# Altium project SimplePowerModule.PrjPCB
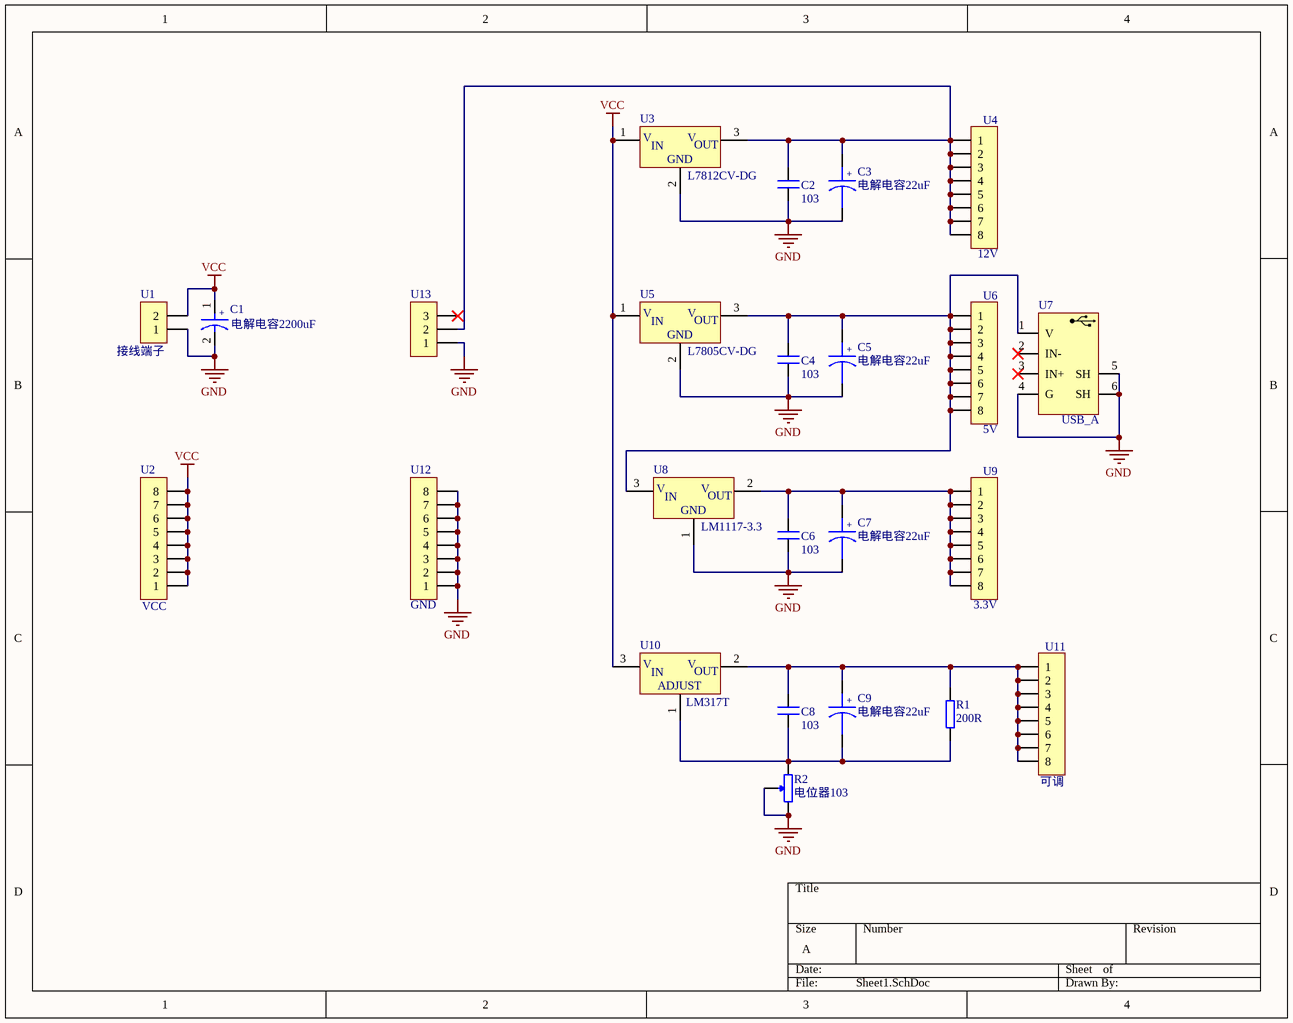
[diagram p0: Sheet1.SchDoc]
1 sheet, 24 parts. Net scope: global (net labels, ports and power ports of the same name join across sheets).
Board file: PCB1.PcbDoc

## Sheet Sheet1.SchDoc
size A

### Parts
C1  电解电容2200uF  [直插电解电容13*21]
C2  103  [贴片电容1206]
C3  电解电容22uF  [直插电解电容5*11]
C4  103  [贴片电容1206]
C5  电解电容22uF  [直插电解电容5*11]
C6  103  [贴片电容1206]
C7  电解电容22uF  [直插电解电容5*11]
C8  103  [贴片电容1206]
C9  电解电容22uF  [直插电解电容5*11]
R1  200R  [贴片电阻1206]
R2  电位器103  [电位器]
U1  接线端子  [KF128-3.81-2P]
U2  VCC  [HDR-1X8]
U3  L7812CV-DG  [TO-220]
U4  12V  [HDR-1X8]
U5  L7805CV-DG  [TO-220]
U6  5V  [HDR-1X8]
U7  USB_A  [USB-A直插]
U8  LM1117-3.3  [TO-220]
U9  3.3V  [HDR-1X8]
U10  LM317T  [TO-220]
U11  可调  [HDR-1X8]
U12  GND  [HDR-1X8]
U13  接插件  [KF2510]  (value not drawn)

### Nets
GND: C1.2 C2.1 C3.2 C4.1 C5.2 C6.1 C7.2 R2.1 R2.2 U1.1 U3.2(GND) U5.2(GND) U7.4(G) U7.5(SH) U7.6(SH) U8.1(GND) U12.1 U12.2 U12.3 U12.4 U12.5 U12.6 U12.7 U12.8 U13.1
VCC: C1.1 U1.2 U2.1 U2.2 U2.3 U2.4 U2.5 U2.6 U2.7 U2.8 U3.1(VIN) U5.1(VIN) U10.3(VIN)
NetC2_2: C2.2 C3.1 U3.3(VOUT) U4.1 U4.2 U4.3 U4.4 U4.5 U4.6 U4.7 U4.8 U13.2
NetC4_2: C4.2 C5.1 U5.3(VOUT) U6.1 U6.2 U6.3 U6.4 U6.5 U6.6 U6.7 U6.8 U7.1(V) U8.3(VIN)
NetC6_2: C6.2 C7.1 U8.2(VOUT) U9.1 U9.2 U9.3 U9.4 U9.5 U9.6 U9.7 U9.8
NetC8_1: C8.1 C9.2 R1.1 R2.3 U10.1(GND)
NetC8_2: C8.2 C9.1 R1.2 U10.2(VOUT) U11.1 U11.2 U11.3 U11.4 U11.5 U11.6 U11.7 U11.8

Not connected (* = marked no-connect by the designer): U7 2(IN-)* 3(IN+)*; U13 3*

### Notes on the sheet
- (in symbol L7805CV-DG) V; IN; OUT
- (in symbol L7812CV-DG) V; IN; OUT
- (in symbol LM317T) V; IN; OUT; ADJUST
- (in symbol LM1117-3.3) V; IN; OUT
- (in symbol 电解电容22uF) +
- (in symbol 电解电容2200uF) +

### Library data of the parts
C2 C4 C6 C8 = Capacitor: 电容; BOM名称: 无极性贴片电容; 版权归属: 源创客; 学习资源: www.ooocke.com
R1 = Resistor: 电阻; BOM名称: 贴片电阻; 版权归属: 源创客; 学习资源: www.ooocke.com
R2 = 电位器: 103; BOM名称: 贴片电阻; 版权归属: 源创客; 学习资源: www.ooocke.com
U1 = Header 2: 2P接插件; 版权归属: 源创客; BOM名称: 2P接插件; 学习资源: www.ooocke.com
U2 U4 U6 U9 U11 U12 = Header 8: 8P接插件; 版权归属: 源创客; BOM名称: 8P接插件; 学习资源: www.ooocke.com
U3 = L7812CV-DG: 3-Terminal Positive Voltage Regulator
U5 = L7805CV-DG: 3-Terminal Positive Voltage Regulator
U8 = LM1117-3.3: 3-Terminal Positive Voltage Regulator
U10 = LM317T: 3-Terminal Positive Voltage Regulator
U13 = Header 3: 3P接插件; 版权归属: 源创客; BOM名称: 3P接插件; 学习资源: www.ooocke.com